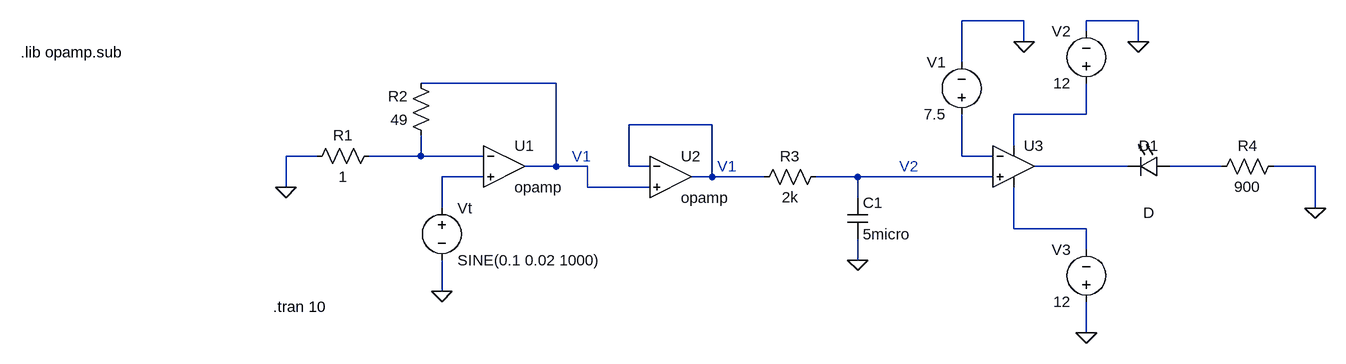
[diagram p0: schematic M2-4-spice.asc.asc]
M2-4-spice.asc.asc, the LTspice schematic file:
Version 4
SHEET 1 1380 680
WIRE 912 -96 816 -96
WIRE 1088 -96 1008 -96
WIRE 1008 -80 1008 -96
WIRE 912 -64 912 -96
WIRE 1088 -64 1088 -96
WIRE 816 -32 816 -96
WIRE 192 0 -16 0
WIRE 1008 48 1008 0
WIRE 1008 48 896 48
WIRE 432 64 304 64
WIRE 896 96 896 48
WIRE -176 112 -224 112
WIRE -16 112 -16 80
WIRE -16 112 -96 112
WIRE 80 112 -16 112
WIRE 816 112 816 48
WIRE 864 112 816 112
WIRE 192 128 192 0
WIRE 192 128 144 128
WIRE 240 128 192 128
WIRE 304 128 304 64
WIRE 336 128 304 128
WIRE 1072 128 928 128
WIRE 1216 128 1136 128
WIRE 1360 128 1296 128
WIRE 80 144 16 144
WIRE 432 144 432 64
WIRE 432 144 400 144
WIRE 512 144 432 144
WIRE 656 144 592 144
WIRE 864 144 656 144
WIRE -224 160 -224 112
WIRE 240 160 240 128
WIRE 336 160 240 160
WIRE 656 176 656 144
WIRE 16 192 16 144
WIRE 1360 192 1360 128
WIRE 896 224 896 160
WIRE 1008 224 896 224
WIRE 1008 256 1008 224
WIRE 656 272 656 240
WIRE 16 320 16 272
WIRE 1008 384 1008 336
FLAG 16 320 0
FLAG -224 160 0
FLAG 656 272 0
FLAG 912 -64 0
FLAG 1360 192 0
FLAG 1008 384 0
FLAG 1088 -64 0
SYMBOL Opamps\\opamp 112 64 R0
SYMATTR InstName U1
SYMBOL voltage 16 176 R0
WINDOW 123 0 0 Left 0
WINDOW 39 0 0 Left 0
SYMATTR InstName Vt
SYMATTR Value SINE(0.1 0.02 1000)
SYMBOL res 0 96 R180
WINDOW 0 36 76 Left 2
WINDOW 3 36 40 Left 2
SYMATTR InstName R2
SYMATTR Value 49
SYMBOL res -192 128 R270
WINDOW 0 32 56 VTop 2
WINDOW 3 0 56 VBottom 2
SYMATTR InstName R1
SYMATTR Value 1
SYMBOL Opamps\\opamp 368 80 R0
SYMATTR InstName U2
SYMBOL res 608 128 R90
WINDOW 0 0 56 VBottom 2
WINDOW 3 32 56 VTop 2
SYMATTR InstName R3
SYMATTR Value 2k
SYMBOL cap 640 176 R0
SYMATTR InstName C1
SYMATTR Value 5micro
SYMBOL voltage 816 64 R180
WINDOW 0 24 96 Left 2
WINDOW 3 24 16 Left 2
SYMATTR InstName V1
SYMATTR Value 7.5
SYMBOL LED 1136 112 R90
WINDOW 0 0 32 VBottom 2
WINDOW 3 72 32 VTop 2
SYMATTR InstName D1
SYMBOL res 1312 112 R90
WINDOW 0 0 56 VBottom 2
WINDOW 3 32 56 VTop 2
SYMATTR InstName R4
SYMATTR Value 900
SYMBOL voltage 1008 16 R180
WINDOW 0 24 96 Left 2
WINDOW 3 24 16 Left 2
SYMATTR InstName V2
SYMATTR Value 12
SYMBOL voltage 1008 352 R180
WINDOW 0 24 96 Left 2
WINDOW 3 24 16 Left 2
SYMATTR InstName V3
SYMATTR Value 12
SYMBOL Opamps\\UniversalOpamp2 896 128 R0
SYMATTR InstName U3
TEXT -244 344 Left 2 !.tran 10
TEXT -632 -48 Left 2 !.lib opamp.sub
TEXT 216 112 Left 2 ;V1
TEXT 440 128 Left 2 ;V1
TEXT 720 128 Left 2 ;V2

The netlist it stands for:
* M2-4-spice.asc.asc
XU1 N004 N008 N001 opamp Aol=100K GBW=10Meg  ; pins invin noninvin out
Vt N008 0 SINE(0.1 0.02 1000)
R2 N004 N001 49
R1 0 N004 1
XU2 N003 N001 N003 opamp Aol=100K GBW=10Meg  ; pins invin noninvin out
R3 N009 N003 2k
C1 N009 0 5micro
V1 N005 0 7.5
D1 N007 N006 D
R4 0 N007 900
V2 N002 0 12
V3 0 N010 12
XU3 N009 N005 N002 N010 N006 level.2 Avol=1Meg GBW=10Meg Slew=10Meg ilimit=25m rail=0 Vos=0 phimargin=45 en=0 enk=0 in=0 ink=0 Rin=500Meg  ; pins IN+ IN- V+ V- OUT
.model D D
.lib standard.dio
.tran 10
.lib opamp.sub
* V1
* V1
* V2
.lib UniversalOpamps2.sub
.backanno
.end